# EAGLE design ptmini (EAGLE 6.6.0)
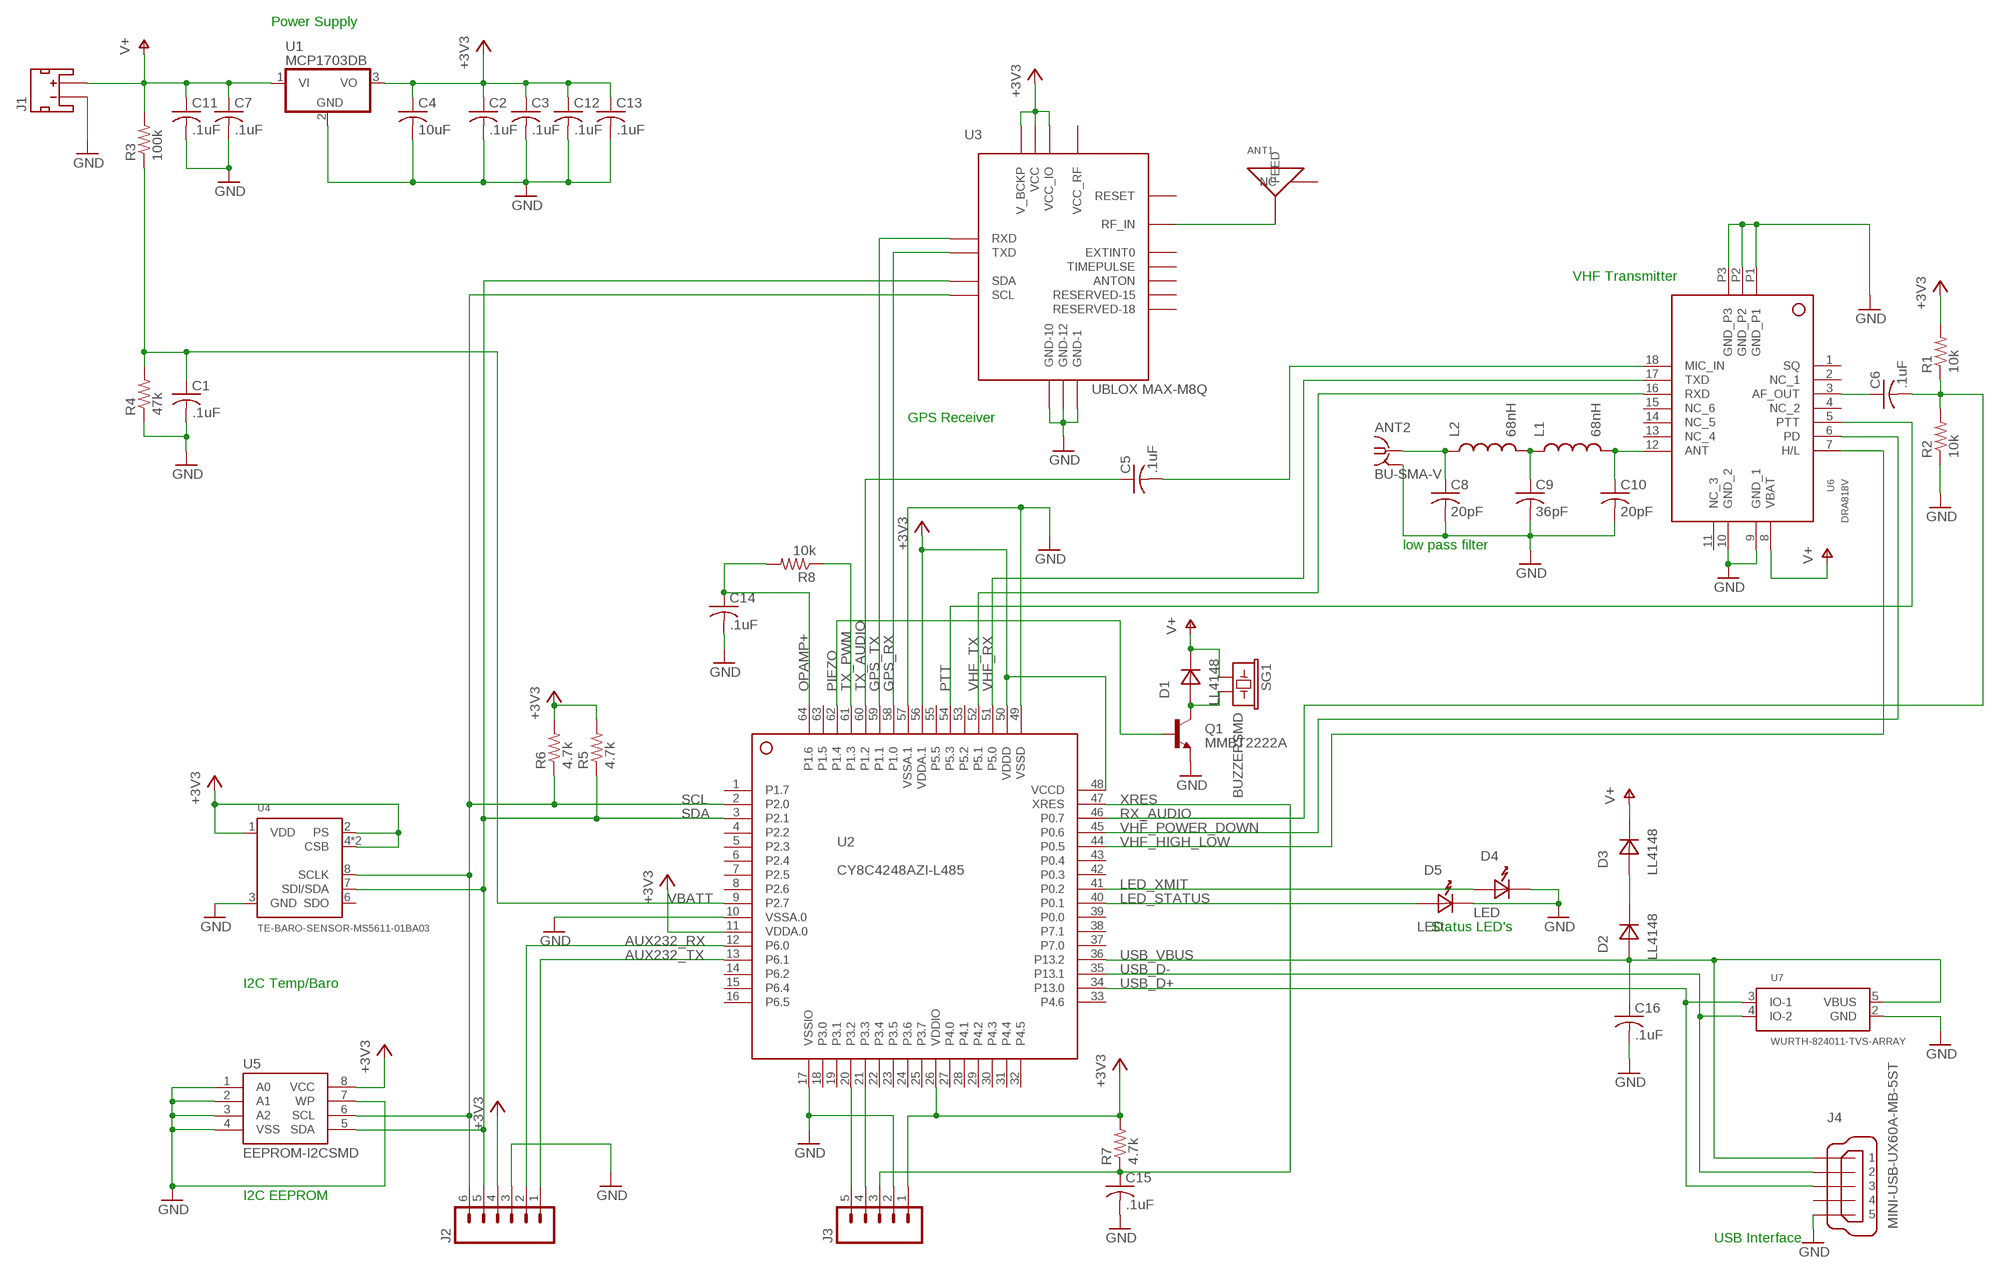
[diagram p0: schematic, sheet 1]

## Parts
ANT1  GPS_ANT_SMDBAR  [1575AT43A40]
ANT2  BU-SMA-V  [BU-SMA-V]
C1  .1uF  C-USC0805  [C0805]
C2  .1uF  C-USC0805  [C0805]
C3  .1uF  C-USC0805  [C0805]
C4  10uF  C-USC0805  [C0805]
C5  .1uF  C-USC0805  [C0805]
C6  .1uF  C-USC0805  [C0805]
C7  .1uF  C-USC0805  [C0805]
C8  20pF  C-USC0805  [C0805]
C9  36pF  C-USC0805  [C0805]
C10  20pF  C-USC0805  [C0805]
C11  .1uF  C-USC0805  [C0805]
C12  .1uF  C-USC0805  [C0805]
C13  .1uF  C-USC0805  [C0805]
C14  .1uF  C-USC0805  [C0805]
C15  .1uF  C-USC0805  [C0805]
C16  .1uF  C-USC0805  [C0805]
D1  LL4148  [SOD-80]
D2  LL4148  [SOD-80]
D3  LL4148  [SOD-80]
D4  LED  [DIODE-1206]
D5  LED  [DIODE-1206]
J1  JST_2MM_MALE  [JST-2-SMD]
J2  M06RA  [MOLEX-1X6-RA]
J3  M05LOCK  [1X05_LOCK]
J4  MINI-USB-UX60A-MB-5ST  [UX60A-MB-5ST]
L1  68nH  INDUCTOR0805  [0805]
L2  68nH  INDUCTOR0805  [0805]
Q1  MMBT2222A  TRANSISTOR_NPNMMBT2222A  [SOT23]
R1  10k  R-US_R0805  [R0805]
R2  10k  R-US_R0805  [R0805]
R3  100k  R-US_R0805  [R0805]
R4  47k  R-US_R0805  [R0805]
R5  4.7k  R-US_R0805  [R0805]
R6  4.7k  R-US_R0805  [R0805]
R7  4.7k  R-US_R0805  [R0805]
R8  10k  R-US_R0805  [R0805]
SG1  BUZZERSMD  [BUZZER-CMT1603]
U1  MCP1703DB  [SOT223]
U2  CY8C4248AZI-L485  [TQFP64-10X10]
U3  UBLOX MAX-M8Q  UBLOX-MAX  [UBLOX-MAX]
U4  TE-BARO-SENSOR-MS5611-01BA03  [TE-BARO-SENSOR-MS5611-01BA3]
U5  EEPROM-I2CSMD  [SO08]
U6  DRA818V  [SMD_DRA818]
U7  WURTH-824011-TVS-ARRAY  [SOT23-5]

## Nets
+3V3: C2.1 C3.1 C4.1 C12.1 C13.1 J2.4 J3.1 R1.2 R5.2 R6.2 R7.2 U1.3(VO) U2.11(VDDA.0) U2.26(VDDIO) U2.48(VCCD) U2.50(VDDD) U2.56(VDDA.1) U3.6_V_BCKP(V_BCKP) U3.7_VCC_IO(VCC_IO) U3.8_VCC(VCC) U4.1(VDD) U4.2(PS) U4.4(CSB) U4.5(CSB) U5.8(VCC)
AUX232_RX: J2.2 U2.12(P6.0)
AUX232_TX: J2.1 U2.13(P6.1)
GND: ANT2.2 ANT2.3 ANT2.4 ANT2.5 C1.2 C2.2 C3.2 C4.2 C7.2 C8.2 C9.2 C10.2 C11.2 C12.2 C13.2 C14.2 C15.2 C16.2 D4.CATHODE D5.CATHODE J1.1(-) J2.3 J3.2 J4.5 Q1.2(E) R2.1 R4.1 U1.2(GND) U2.10(VSSA.0) U2.17(VSSIO) U2.49(VSSD) U2.57(VSSA.1) U3.1_GND(GND-1) U3.10_GND(GND-10) U3.12_GND(GND-12) U4.3(GND) U5.1(A0) U5.2(A1) U5.3(A2) U5.4(VSS) U5.7(WP) U6.9(GND_1) U6.10(GND_2) U6.P1(GND_P1) U6.P2(GND_P2) U6.P3(GND_P3) U7.2(GND)
GPS_RX: U2.58(P1.0) U3.2_TXD1(TXD)
GPS_TX: U2.59(P1.1) U3.3_RXD1(RXD)
LED_STATUS: D5.ANODE U2.40(P0.1)
LED_XMIT: D4.ANODE U2.41(P0.2)
N$1: D1.ANODE Q1.3(C) SG1.P$2
N$2: C5.2 U6.18(MIC_IN)
N$4: ANT1.FEED U3.11_RF_IN(RF_IN)
N$5: D2.CATHODE D3.ANODE
N$8: C6.1 U6.3(AF_OUT)
N$15: ANT2.1 C8.1 L2.1
N$21: C9.1 L1.1 L2.2
N$22: C10.1 L1.2 U6.12(ANT)
N$27: J3.5 U2.20(P3.2)
N$28: J3.4 U2.21(P3.3)
OPAMP+: C14.1 R8.2 U2.64(P1.6)
PIEZO: Q1.1(B) U2.62(P1.4)
PTT: U2.54(P5.3) U6.5(PTT)
RX_AUDIO: C6.2 R1.1 R2.2 U2.46(P0.7)
SCL: J2.6 R6.1 U2.2(P2.0) U3.17_SCL2(SCL) U4.8(SCLK) U5.6(SCL)
SDA: J2.5 R5.1 U2.3(P2.1) U3.16_SDA2(SDA) U4.7(SDI/SDA) U5.5(SDA)
TX_AUDIO: C5.1 U2.60(P1.2)
TX_PWM: R8.1 U2.61(P1.3)
USB_D+: J4.3 U2.34(P13.0) U7.3(IO-1)
USB_D-: J4.2 U2.35(P13.1) U7.4(IO-2)
USB_VBUS: C16.1 D2.ANODE J4.1 U2.36(P13.2) U7.5(VBUS)
V+: C7.1 C11.1 D1.CATHODE D3.CATHODE J1.2(+) R3.2 SG1.P$1 U1.1(VI) U6.8(VBAT)
VBATT: C1.1 R3.1 R4.2 U2.9(P2.7)
VHF_HIGH_LOW: U2.44(P0.5) U6.7(H/L)
VHF_POWER_DOWN: U2.45(P0.6) U6.6(PD)
VHF_RX: U2.51(P5.0) U6.17(TXD)
VHF_TX: U2.52(P5.1) U6.16(RXD)
XRES: C15.1 J3.3 R7.1 U2.47(XRES)
Unconnected: ANT1.NC J1.NC1(PAD1) J1.NC2(PAD2) J4.4 U2.1(P1.7) U2.4(P2.2) U2.5(P2.3) U2.6(P2.4) U2.7(P2.5) U2.8(P2.6) U2.14(P6.2) U2.15(P6.4) U2.16(P6.5) U2.18(P3.0) U2.19(P3.1) U2.22(P3.4) U2.23(P3.5) U2.24(P3.6) U2.25(P3.7) U2.27(P4.0) U2.28(P4.1) U2.29(P4.2) U2.30(P4.3) U2.31(P4.4) U2.32(P4.5) U2.33(P4.6) U2.37(P7.0) U2.38(P7.1) U2.39(P0.0) U2.42(P0.3) U2.43(P0.4) U2.53(P5.2) U2.55(P5.5) U2.63(P1.5) U3.4_TIMEPULSE(TIMEPULSE) U3.5_EXTINT0(EXTINT0) U3.13_ANTON(ANTON) U3.14_VCC_RF(VCC_RF) U3.15_RESERVED(RESERVED-15) U3.18_RESERVED(RESERVED-18) U4.6(SDO) U6.1(SQ) U6.2(NC_1) U6.4(NC_2) U6.11(NC_3) U6.13(NC_4) U6.14(NC_5) U6.15(NC_6)

## Notes on the sheet
- Power Supply
- VHF Transmitter
- GPS Receiver
- low pass filter
- Status LED's
- I2C Temp/Baro
- I2C EEPROM
- USB Interface

## Power pins joined to a net without a drawn wire
RESET: U3.9_V_RESET(RESET)

## Library data of the parts
ANT1 = Parts:GPS_ANT_SMDBAR: 1.575 GHz GPS Antenna Johanson Technology http://www.digikey.com/product-detail/en/1575AT43A0040E/712-1003-1-ND/1560832; DIGIKEY: 712-1003-1-ND
ANT2 = con-coax:BU-SMA-V: FEMALE SMA CONNECTOR Radiall distributor RS 112-3794; DIGIKEY: CONSMA001-ND; OC_FARNELL: unknown; OC_NEWARK: unknown
C1-C3 C5-C7 C11-C16 = resistor:C-US: CAPACITOR, American symbol; DIGIKEY: 311-1361-1-ND
C4 = resistor:C-US: CAPACITOR, American symbol; DIGIKEY: 490-3886-1-ND
C8 C10 = resistor:C-US: CAPACITOR, American symbol; DIGIKEY: 712-1381-1-ND
C9 = resistor:C-US: CAPACITOR, American symbol; DIGIKEY: 712-1387-1-ND
D1-D3 = custom-ds:LL4148: General purpose LL1448 Diode in the SOD-80 (glass tube) form factor.; DIGIKEY: 568-1749-1-ND
D4 = custom-ds:LED: Light Emitting Diode (LED) in a 1206 SMT package.; DIGIKEY: 160-1405-1-ND
D5 = custom-ds:LED: Light Emitting Diode (LED) in a 1206 SMT package.; DIGIKEY: 160-1169-1-ND
J1 = SparkFun-Connectors:JST_2MM_MALE: Mates to single-cell LiPo batteries. CONN-08352; DIGIKEY: 455-1749-1-ND; PROD_ID: CONN-08352
J2 = SparkFun-Connectors:M06: Header 6 Standard 6-pin 0.1" header. Use with straight break away headers (SKU : PRT-00116), right angle break away headers (PRT-00553), swiss pins (PRT-00743), machine pins (PRT-00117), and female headers (PRT-00115). Molex polarized connector foot print use with SKU : PRT-08094 with associated crimp pins and housings. NOTES ON THE VARIANTS LOCK and LOCK_LONGPADS... This footprint was designed to help hold the alignment of a through-hole component (i.e. 6-pin header) while soldering it into place. You may notice that each hole has been shifted either up or down by 0.005 of an inch from it's more standard position (which is a perfectly straight line). This slight alteration caused the pins (the squares in the middle) to touch the edges of the holes. Because they are alternating, it causes a "brace" to hold the component in place. 0.005 has proven to be the perfect amount of "off-center" position when using our standard breakaway headers. Although looks a little odd when you look at the bare footprint, once you have a header in there, the alteration is very hard to notice. Also,if you push a header all the way into place, it is covered up entirely on the bottom side. This idea of altering the position of holes to aid alignment will be further integrated into the Sparkfun Library for other footprints. It can help hold any component with 3 or more connection pins.; DIGIKEY: WM4304-ND
J3 = SparkFun-Connectors:M05: Header 5 Standard 5-pin 0.1" header. Use with straight break away headers (SKU : PRT-00116), right angle break away headers (PRT-00553), swiss pins (PRT-00743), machine pins (PRT-00117), and female headers (PRT-00115). Molex polarized connector foot print use with SKU : PRT-08230 with associated crimp pins and housings.; DIGIKEY: SAM1112-32-ND
J4 = con-hirose:MINI-USB-: MINI USB Connector Source: http://www.hirose.co.jp/cataloge_hp/e24000019.pdf; DIGIKEY: H2961CT-ND; OC_FARNELL: unknown; OC_NEWARK: unknown
L1 L2 = SparkFun-Passives:INDUCTOR: Inductors Basic Inductor/Choke - 0603 and 1206. Footprints are not proven and vary greatly between part numbers. SRN6045- 33uH, 20% 1.4A SDR0403-560KL - 56uH, 10%, 500mA RMS/740mA peak; DIGIKEY: AISC-0805-R068G-TCT-ND
Q1 = SparkFun-DiscreteSemi:TRANSISTOR_NPN: Generic NPN BJT MMBT2222A - TRANS-08049 (SOT-23, 1A 40V) MPSA42 - TRANS-09116 (SOT-23, 500mA 300V) MMBT5088LT1G - TRANS-11160 (SOT-23, 50 mA 30V); DIGIKEY: MMBT2222AFSCT-ND; PROD_ID: TRANS-08049
R1 R2 R8 = resistor:R-US_: RESISTOR, American symbol; DIGIKEY: 311-10.0KCRCT-ND
R3 = resistor:R-US_: RESISTOR, American symbol; DIGIKEY: 311-100KCRCT-ND
R4 = resistor:R-US_: RESISTOR, American symbol; DIGIKEY: 311-47.0KCRCT-ND
R5-R7 = resistor:R-US_: RESISTOR, American symbol; DIGIKEY: 311-4.7KARCT-ND
SG1 = SparkFun-Electromechanical:BUZZER: Buzzer 12mm Spark Fun Electronics SKU : Comp-Buzzer; DIGIKEY: 102-1193-1-ND
U1 = linear:MCP1703: 250 mA, 16V, Low Quiescent Current LDO Regulator Source: http://ww1.microchip.com/downloads/en/DeviceDoc/22049b.pdf; DIGIKEY: MCP1703T-3302E/DBCT-ND
U2 = custom-ds:CY8C4248AZI-L485: Cypress PSoC 4200 series chip. Specifically tested with CY8C4248AZI-L485. Note this is a 10mm square TQFP-64.; DIGIKEY: 428-3598-ND
U3 = custom-ds:UBLOX-MAX: UBlox MAX-series of GPS receiver engines.
U4 = custom-ds:TE-BARO-SENSOR-MS5611-01BA03: TE Connectivity High Precision Barometric Pressure Sensor.; DIGIKEY: 223-1622-1-ND
U5 = SparkFun-DigitalIC:EEPROM-I2C: I2C EEPROM chips, 24LC256 (and others); DIGIKEY: 24LC64F-I/SN-ND
U6 = DRA818V:DRA818V: DRA818V is a compact wireless voice transceiver from Dorji. http://www.dorji.com/pro/Modules/Audio_voice_transceiver.html
U7 = custom-ds:WURTH-824011-TVS-ARRAY: USB TVS Protection array such as Wurth Elektronik 824011.; DIGIKEY: 732-4465-1-ND

## Board
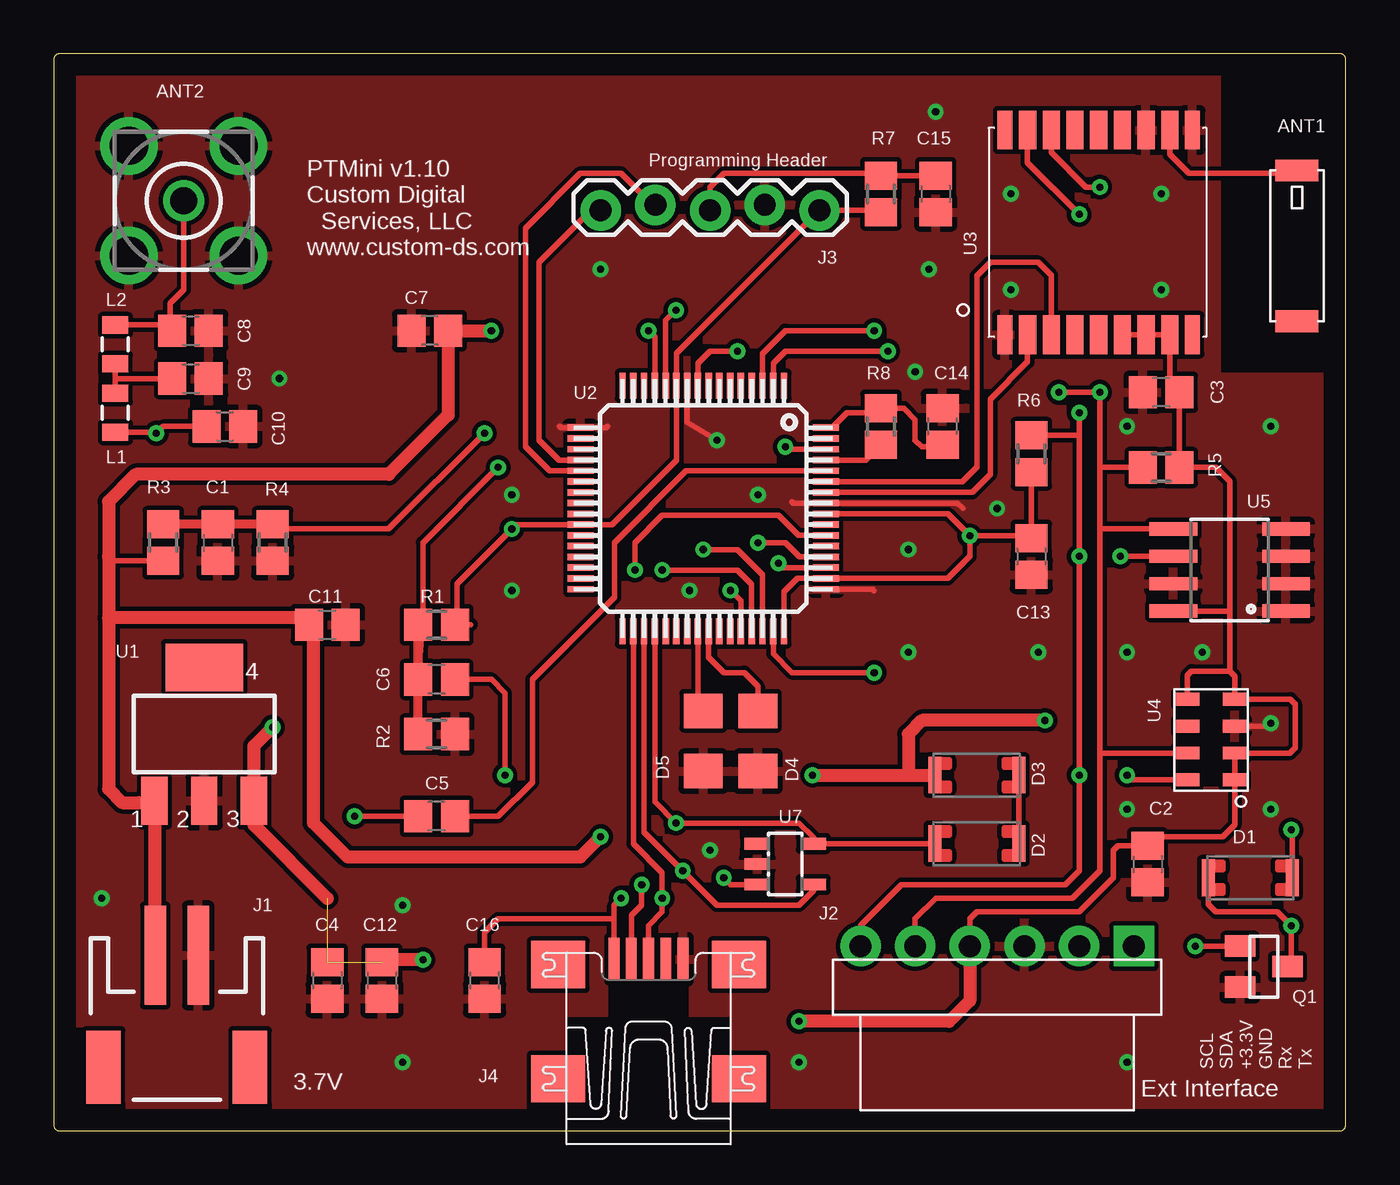
[diagram p1: board, top side]
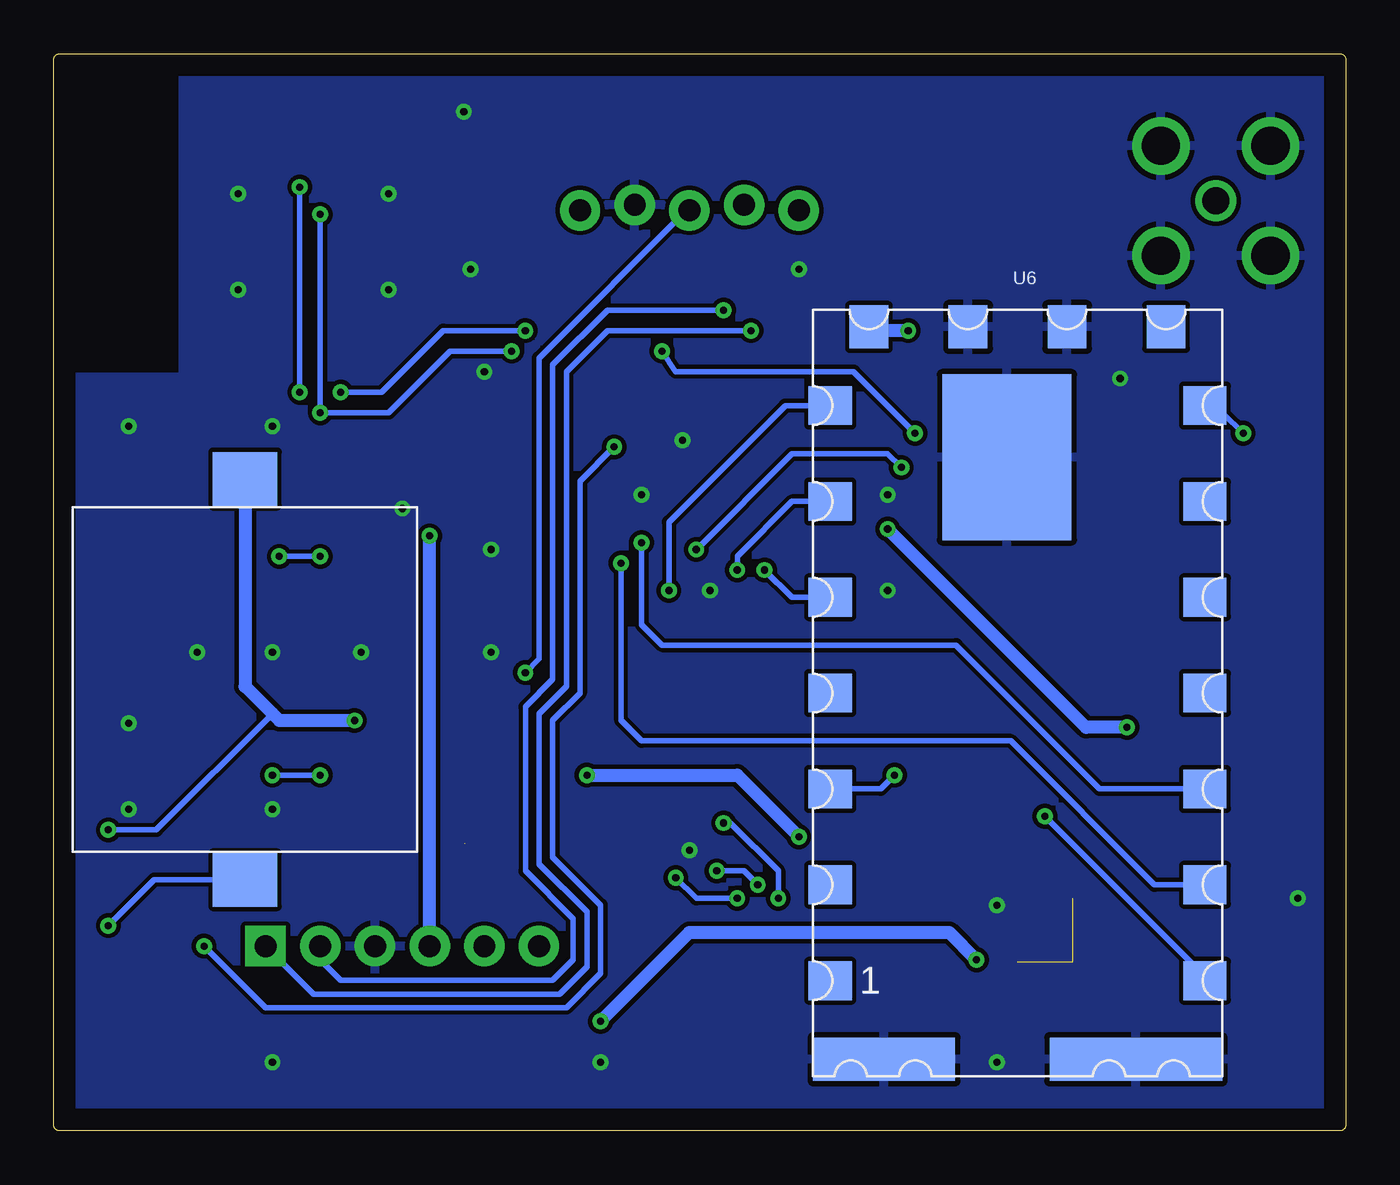
[diagram p2: board, bottom side, seen from below]

Size 60 x 50 mm. Coordinates in mm from the lower left corner, seen from the top.
Outline: 0,49.75 0,0.25 arc90 0.25,0 59.75,0 arc90 60,0.25 60,49.75 arc90 59.75,50 0.25,50 arc90 0,49.75
Copper layers (1*16): Top 0.035mm / dielectric 1.5mm / Bottom 0.035mm
Design rules "default *": minimum track width 10mil, minimum drill 13mil, track to track 8mil, track to pad 8mil, pad to pad 8mil, via to via 8mil, smd to smd 8mil, copper to edge 40mil, drill to drill 8mil, minimum pad ring 10mil, minimum via ring 8mil, stop-mask expansion 4mil, vias tented up to drill 0mil, thermal gap 10mil

### Footprints (pad centres in the part's own frame; a part is rotated, then mirrored left to right if it is on the bottom)
1575AT43A40 = smd 1 x 2: FEED 0.5,-1; NC 7.5,-1
BU-SMA-V = drill 1.27: 1 0,0 | drill 1.778: 2 -2.55,2.55; 3 2.55,2.55; 4 2.55,-2.55; 5 -2.55,-2.55
C0805 = smd 1.3 x 1.5: 1 -0.85,0; 2 0.85,0
SOD-80 = smd 0.6 x 1.7: ANODE -1.95,0; CATHODE 1.95,0
DIODE-1206 = smd 1.6 x 1.8: ANODE -1.4,0; CATHODE 1.4,0
JST-2-SMD = smd 1 x 4.6: 1 -1,-3.7; 2 1,-3.7 | smd 1.6 x 3.4: NC1 -3.4,1.5; NC2 3.4,1.5
MOLEX-1X6-RA = drill 1.016 pad 1.88 square: 1 0,0 | drill 1.016 pad 1.88: 2 2.54,0; 3 5.08,0; 4 7.62,0; 5 10.16,0; 6 12.7,0
1X05_LOCK = drill 1.016 pad 1.88: 1 0,0.127; 2 2.54,-0.127; 3 5.08,0.127; 4 7.62,-0.127; 5 10.16,0.127
UX60A-MB-5ST = smd 2 x 0.5: 1 2.25,1.6; 2 2.25,0.8; 3 2.25,0; 4 2.25,-0.8; 5 2.25,-1.6 | smd 2.2 x 2.5: M1 -3.3,-4.2; M2 -3.3,4.2; M3 2,4.2; M4 2,-4.2
0805 = smd 0.8 x 1.2: 1 -0.9,0; 2 0.9,0
SOT23 = smd 1 x 1.4: 1 -0.95,-1.1; 2 0.95,-1.1; 3 0,1.1
R0805 = smd 1.3 x 1.5: 1 -0.85,0; 2 0.85,0
BUZZER-CMT1603 = smd 2.5 x 3: P$1 -9.3,0; P$2 9.3,0
SOT223 = smd 1.219 x 2.235: 1 -2.311,-3.099; 2 0,-3.099; 3 2.311,-3.099 | smd 3.6 x 2.2: 4 0,3.099
TQFP64-10X10 = smd 1.2 x 0.297: 1 -5.7,3.75; 2 -5.7,3.25; 4 -5.7,2.25; 5 -5.7,1.75; 6 -5.7,1.25; 7 -5.7,0.75; 8 -5.7,0.25; 9 -5.7,-0.25; 10 -5.7,-0.75; 11 -5.7,-1.25; 12 -5.7,-1.75; 13 -5.7,-2.25; 14 -5.7,-2.75; 15 -5.7,-3.25; 16 -5.7,-3.75; 33 5.7,-3.75; 34 5.7,-3.25; 35 5.7,-2.75; 36 5.7,-2.25; 37 5.7,-1.75; 38 5.7,-1.25; 39 5.7,-0.75; 40 5.7,-0.25; 41 5.7,0.25; 42 5.7,0.75; 43 5.7,1.25; 44 5.7,1.75; 45 5.7,2.25; 46 5.7,2.75; 47 5.7,3.25; 48 5.7,3.75 | smd 1.2 x 0.3: 3 -5.7,2.75 | smd 0.297 x 1.2: 17 -3.75,-5.7; 18 -3.25,-5.7; 19 -2.75,-5.7; 20 -2.25,-5.7; 21 -1.75,-5.7; 22 -1.25,-5.7; 23 -0.75,-5.7; 24 -0.25,-5.7; 25 0.25,-5.7; 26 0.75,-5.7; 27 1.25,-5.7; 28 1.75,-5.7; 29 2.25,-5.7; 30 2.75,-5.7; 31 3.25,-5.7; 32 3.75,-5.7; 49 3.75,5.7; 50 3.25,5.7; 51 2.75,5.7; 52 2.25,5.7; 53 1.75,5.7; 54 1.25,5.7; 55 0.75,5.7; 56 0.25,5.7; 57 -0.25,5.7; 58 -0.75,5.7; 59 -1.25,5.7; 60 -1.75,5.7; 61 -2.25,5.7; 62 -2.75,5.7; 63 -3.25,5.7; 64 -3.75,5.7
UBLOX-MAX = smd 1.8 x 0.7: 1_GND -4.95,4.4; 9_V_RESET -4.95,-4.3; 10_GND 4.55,-4.3; 18_RESERVED 4.55,4.4 | smd 1.8 x 0.8: 2_TXD1 -4.95,3.35; 3_RXD1 -4.95,2.25; 4_TIMEPULSE -4.95,1.15; 5_EXTINT0 -4.95,0.05; 6_V_BCKP -4.95,-1.05; 7_VCC_IO -4.95,-2.15; 8_VCC -4.95,-3.25; 11_RF_IN 4.55,-3.25; 12_GND 4.55,-2.15; 13_ANTON 4.55,-1.05; 14_VCC_RF 4.55,0.05; 15_RESERVED 4.55,1.15; 16_SDA2 4.55,2.25; 17_SCL2 4.55,3.35
TE-BARO-SENSOR-MS5611-01BA3 = smd 1.1 x 0.6: 1 -1,2; 2 -1,0.75; 3 -1,-0.5; 4 -1,-1.75; 5 1.2,-1.75; 6 1.2,-0.5; 7 1.2,0.75; 8 1.2,2
SO08 = smd 0.61 x 2.21: 1 -1.905,-2.616; 2 -0.635,-2.616; 3 0.635,-2.616; 4 1.905,-2.616; 5 1.905,2.616; 6 0.635,2.616; 7 -0.635,2.616; 8 -1.905,2.616
SMD_DRA818 = smd 1.8 x 2: 1 -13.35,8.7; 2 -8.9,8.7; 3 -4.45,8.7; 4 0,8.7; 5 4.45,8.7; 6 8.9,8.7; 7 13.35,8.7; 12 13.35,-8.7; 13 8.9,-8.7; 14 4.45,-8.7; 15 0,-8.7; 16 -4.45,-8.7; 17 -8.9,-8.7; 18 -13.35,-8.7 | smd 2 x 1.8: 8 17,6.9; 9 17,2.3; 10 17,-2.3; 11 17,-6.9 | smd 7.7 x 6: P1 10.95,0.5 | smd 2 x 6.6: P2 -17,6.2 | smd 2 x 8: P3 -17,-5.5
SOT23-5 = smd 0.55 x 1.2: 1 -0.95,-1.3; 2 0,-1.3; 3 0.95,-1.3; 4 0.95,1.3; 5 -0.95,1.3

### Placement (x,y rotation side)
ANT1  58.74,45.09 270 top
ANT2  6.03,43.18 0 top
C1  7.62,27.3 270 top
C2  50.8,12.38 270 top
C3  51.44,34.29 180 top
C4  12.7,6.99 270 top
C5  17.78,14.61 180 top
C6  17.78,20.95 180 top
C7  17.46,37.15 180 top
C8  6.35,37.15 0 top
C9  6.35,34.92 0 top
C10  7.94,32.7 0 top
C11  12.7,23.5 0 top
C12  15.24,6.99 270 top
C13  45.4,26.67 270 top
C14  41.27,32.7 90 top
C15  40.96,43.5 270 top
C16  20,6.99 270 top
D1  55.56,11.75 0 top
D2  42.86,13.34 0 top
D3  42.86,16.51 180 top
D4  32.7,18.1 270 top
D5  30.16,18.1 270 top
J1  5.71,4.45 180 top
J2  50.16,8.57 180 top
J3  35.56,42.86 180 top
J4  27.62,5.71 90 top
L1  2.86,33.34 270 top
L2  2.86,36.51 270 top
Q1  56.2,7.62 270 top
R1  17.78,23.5 0 top
R2  17.78,18.41 180 top
R3  5.08,27.3 270 top
R4  10.16,27.3 90 top
R5  51.44,30.8 0 top
R6  45.4,31.43 270 top
R7  38.42,43.5 270 top
R8  38.42,32.7 90 top
SG1  51.12,20.95 270 bottom
U1  6.99,18.41 0 top
U2  30.16,28.89 270 top
U3  48.58,41.91 90 top
U4  53.85,18.29 180 top
U5  54.61,26.04 90 top
U6  15.24,20.32 90 bottom
U7  33.97,12.38 270 top

### Tracks (layer width: path | path; a pad name or v marks a point on that pad's centre or on a via)
+3V3  (via drill 0.33)  (2 unrouted)
  Top 0.254: 19.37,23.5 R1.2 | R1.2 18.41,23.5 | 21.34,28.01 v21.27,27.94 | U3.8_VCC U3.7_VCC_IO U3.6_V_BCKP | U2.48 33.91,25.02 34.53,25.64 U2.50 41.52,25.64 42.55,26.67 v42.55,27.62 | v21.27,27.94 21.48,28.14 U2.26 25.92,28.14 28.91,31.14 U2.11 28.91,36.09 J3.1 38.33,42.74 R7.2 | 54.61,24.13 54.61,30.16 53.98,30.8 R5.2 C3.1 51.83,34.75 U3.8_VCC | U5.8 54.61,24.13 | J2.4 42.55,9.84 42.86,10.16 47.62,10.16 49.21,11.75 49.21,13.02 49.43,13.23 C2.1 51.22,13.65 54.29,13.65 54.85,14.21 U4.1 U4.2 57.42,17.54 57.66,17.78 57.66,19.81 57.43,20.04 U4.4 54.85,21.1 54.61,21.34 | v42.55,27.62 45.3,27.62 C13.1 R6.2 | U2.56 41.52,28.64 v42.55,27.62 | U3.8_VCC 51.83,37.29 | v21.27,27.94 18.73,25.4 18.73,23.6 R1.2 | 54.61,24.13 54.61,21.34 | U4.5 52.65,21.15 52.83,21.34 54.61,21.34
  Top 0.61: v10.16,18.73 9.3,17.87 U1.3 9.3,14.2 12.7,10.79 | J2.4 42.55,6.03 41.59,5.08 v34.61,5.08 | v17.14,7.94 15.34,7.94 C12.1
  Bottom 0.61: v10.16,18.73 12.06,18.73 v21.27,27.94 | v34.61,5.08 30.48,9.21 18.41,9.21 v17.14,7.94 | J2.4 v42.55,27.62
AUX232_RX  (via drill 0.33)
  Top 0.254: U2.12 28.41,37.62 v28.89,38.1
  Bottom 0.254: v28.89,38.1 34.29,38.1 36.83,35.56 36.83,20.95 38.1,19.68 38.1,12.06 35.88,9.84 35.88,7.94 36.83,6.99 46.67,6.99 47.62,7.94 J2.2
AUX232_TX  (via drill 0.33)
  Top 0.254: U2.13 27.91,36.86 v27.62,37.15
  Bottom 0.254: v27.62,37.15 34.29,37.15 36.2,35.24 36.2,20.64 37.47,19.37 37.47,12.38 35.24,10.16 35.24,7.62 36.51,6.35 47.94,6.35 J2.1
GND  (via drill 0.33)
  Top 0.254: U2.10 29.41,32.91 v30.8,32.07 | 34.29,29.21 34.36,29.14 U2.57 41.98,29.14 42.23,28.89 | 23.5,32.7 23.55,32.64 U2.17 25.66,32.64 25.72,32.7 | U2.49 38.04,25.14 38.1,25.08 | U4.3 56.38,18.79 v56.52,18.92
  other vias: 40.96,47.31 40.64,40.01 39.69,26.99 25.4,40.01 49.85,32.7 29.53,25.08 43.81,28.89 51.44,43.5 53.34,22.23 56.52,14.92 32.7,29.53 49.85,14.92 44.45,43.5 45.72,22.23 51.44,39.05 40.01,35.24 39.69,22.23 44.45,39.05 56.52,32.7 10.48,34.92 16.19,3.17 21.27,29.53 2.22,10.79 34.61,3.17 16.19,10.48 49.85,3.17 49.85,22.23 30.48,13.02 21.27,25.08
  pour Top: 54,35 60,35 60,0 0,0 0,50 54,50
  pour Bottom: 60,35 54,35 54,50 0,50 0,0 60,0
GPS_RX
  Top 0.254: U2.58 42.66,29.64 43.5,30.48 43.5,33.97 45.23,35.7 U3.2_TXD1 45.23,36.97
GPS_TX
  Top 0.254: U2.59 42.21,30.14 42.86,30.8 42.86,39.69 43.5,40.32 45.72,40.32 46.33,39.72 U3.3_RXD1
LED_STATUS
  Top 0.254: U2.40 29.91,19.75 D5.ANODE
LED_XMIT
  Top 0.254: U2.41 30.41,21.98 31.11,21.27 32.07,21.27 32.7,20.64 D4.ANODE
N$1  (via drill 0.33)
  Top 0.254: Q1.3 57.47,7.79 v57.47,9.53 56.83,10.16 53.98,10.16 53.61,10.52 D1.ANODE
  Bottom 0.254: SG1.P$2 55.34,11.65 v57.47,9.53
N$2  (via drill 0.33)
  Top 0.254: v13.97,14.61 C5.2
  Bottom 0.254: U6.18 6.54,7.17 v13.97,14.61
N$4
  Top 0.254: U3.11_RF_IN 51.83,45.33 52.7,44.45 57.6,44.45 ANT1.FEED
N$5
  Top 0.254: D2.CATHODE D3.ANODE
N$8  (via drill 0.33)
  Top 0.254: v20.95,16.51 20.95,20.32 20.32,20.95 C6.1
  Bottom 0.254: v20.95,16.51 21.59,15.88 U6.3
N$15
  Top 0.254: L2.1 5.24,37.41 C8.1 5.4,37.25 5.4,38.42 6.03,39.05 ANT2.1
N$21
  Top 0.254: L1.1 2.86,34.92 | 2.86,34.92 L2.2 | C9.1 2.86,34.92
N$22  (via drill 0.33)
  Top 0.254: L1.2 4.71,32.44 v4.76,32.38 5.08,32.7 C10.1
  Bottom 0.254: U6.12 5.7,33.67 5.7,33.32 v4.76,32.38
N$27
  Top 0.254: U2.20 23.47,31.14 22.54,32.07 22.54,40.32 24.96,42.74 J3.5
N$28
  Top 0.254: U2.21 23.02,30.64 21.91,31.75 21.91,41.91 24.45,44.45 26.35,44.45 27.81,42.99 J3.4
OPAMP+
  Top 0.254: U2.64 36.13,32.64 36.83,33.34 38.2,33.34 R8.2 39.47,33.55 40.01,33.02 40.01,32.07 40.32,31.75 41.17,31.75 C14.1
PIEZO  (via drill 0.33)
  Top 0.254: U2.62 34.08,31.64 v33.97,31.75 | Q1.1 v53.02,8.57
  Bottom 0.254: v33.97,31.75 35.56,30.16 35.56,20.32 36.83,19.05 36.83,12.7 34.61,10.48 34.61,7.3 36.2,5.71 50.16,5.71 v53.02,8.57
PTT  (via drill 0.33)
  Top 0.254: U2.54 34.59,27.64 33.66,28.57 28.26,28.57 26.99,27.3 v26.99,26.04
  Bottom 0.254: U6.5 25.72,24.77 v26.99,26.04
RX_AUDIO  (via drill 0.33)
  Top 0.254: v20.64,30.8 17.14,27.3 17.14,23.71 C6.2 | U2.46 32.91,25.82 31.75,26.99 v30.16,26.99
  Top 0.406: R2.2 R1.1 C6.2
  Bottom 0.254: v30.16,26.99 25.72,31.43 21.27,31.43 v20.64,30.8
SCL  (via drill 0.33)
  Top 0.254: v47.62,33.34 47.62,32.38 | 47.62,32.38 v47.62,26.67 v47.62,16.51 47.62,12.06 46.99,11.43 39.37,11.43 37.47,9.53 J2.6 | U2.2 33.41,35.63 33.97,36.2 v38.73,36.2 | U5.6 v49.53,26.67 | 49.94,16.41 v49.85,16.51 50.07,16.29 U4.8 | v47.62,42.55 45.23,44.94 U3.17_SCL2 | R6.1 47.52,32.28 47.62,32.38
  Bottom 0.254: v49.53,26.67 v47.62,26.67 | v49.85,16.51 v47.62,16.51 | v47.62,42.55 v47.62,33.34 44.45,33.34 41.59,36.2 v38.73,36.2
SDA  (via drill 0.33)
  Top 0.254: 48.58,30.8 v48.58,34.29 v46.67,34.29 | 48.58,30.8 48.58,27.94 | U2.3 32.91,36.09 33.97,37.15 v38.1,37.15 | U5.5 48.58,27.94 | 48.58,27.94 48.58,17.53 | 48.58,17.53 48.58,12.06 47.31,10.79 40.96,10.79 40.01,9.84 J2.5 | R5.1 48.58,30.8 | U3.16_SDA2 46.33,45.43 47.94,43.81 v48.58,43.81 | U4.7 48.59,17.54 48.58,17.53
  Bottom 0.254: v48.58,43.81 v48.58,34.29 | v46.67,34.29 44.77,34.29 41.91,37.15 v38.1,37.15
TX_AUDIO
  Top 0.254: C5.1 20.64,14.61 22.23,16.19 22.23,20.95 26.04,24.77 26.04,27.3 29.37,30.64 U2.60
TX_PWM
  Top 0.254: U2.61 37.71,31.14 R8.1
USB_D+  (via drill 0.33)
  Top 0.254: U2.34 26.91,13.34 28.26,11.99 v28.26,10.79 28.26,10.16 27.62,9.53 J4.3 | U7.3 31.43,11.43 v31.11,11.75
  Bottom 0.254: v28.26,10.79 30.16,10.79 v31.11,11.75
USB_D-  (via drill 0.33)
  Top 0.254: U2.35 27.41,13.86 v29.21,12.06 30.8,10.48 34.61,10.48 35.27,11.14 U7.4 | J4.2 26.82,9.99 27.3,10.48 v27.3,11.43
  Bottom 0.254: v29.21,12.06 27.94,12.06 v27.3,11.43
USB_VBUS  (via drill 0.33)  (1 unrouted)
  Top 0.254: U2.36 27.91,15.27 v28.89,14.29 34.61,14.29 35.27,13.62 U7.5 D2.ANODE | J4.1 26.02,9.84 | 26.02,9.84 26.02,10.46 v26.35,10.79 | C16.1 20,9.21 20.64,9.84 26.02,9.84
  Bottom 0.254: v28.89,14.29 28.57,14.29 26.35,12.06 v26.35,10.79
V+  (via drill 0.33)
  Top 0.254: R3.2 2.75,26.45 2.54,26.67 | D1.CATHODE 57.51,13.93 v57.47,13.97
  Top 0.61: 2.54,23.81 2.54,26.67 2.54,29.21 3.81,30.48 15.56,30.48 18.31,33.23 C7.1 v20.32,37.15 | 2.54,23.81 2.54,15.88 3.17,15.24 3.96,15.24 U1.1 4.71,15.28 J1.2 | v25.4,13.65 24.45,12.7 13.65,12.7 12.06,14.29 12.06,23.28 C11.1 11.53,23.81 2.54,23.81 | v35.24,16.51 39.69,16.51 | 39.69,16.51 D3.CATHODE | v46.04,19.05 40.32,19.05 39.69,18.41 39.69,16.51
  Bottom 0.254: v57.47,13.97 55.24,13.97 49.85,19.37
  Bottom 0.61: 22.14,37.55 U6.8 21.97,37.15 v20.32,37.15 | v35.24,16.51 28.26,16.51 v25.4,13.65 | v46.04,19.05 49.53,19.05 49.85,19.37 51.12,20.64 SG1.P$1
VBATT  (via drill 0.33)
  Top 0.254: v20,32.38 15.56,27.94 10.38,27.94 R4.2 | U2.9 29.91,35.63 30.48,36.2 v31.75,36.2
  Top 0.406: R4.2 C1.1 R3.1
  Bottom 0.254: v20,32.38 22.86,35.24 31.11,35.24 v31.75,36.2
VHF_HIGH_LOW  (via drill 0.33)
  Top 0.254: U2.44 31.91,24.6 v31.43,25.08
  Bottom 0.254: v31.43,25.08 31.43,28.26 26.02,33.67 U6.7
VHF_POWER_DOWN  (via drill 0.33)
  Top 0.254: U2.45 32.41,25.37 31.75,26.04 v28.26,26.04
  Bottom 0.254: U6.6 25.71,29.22 28.26,26.67 v28.26,26.04
VHF_RX  (via drill 0.33)
  Top 0.254: U2.51 33.87,26.14 v33.66,26.35
  Bottom 0.254: U6.17 8.88,11.42 15.56,18.1 32.7,18.1 33.66,19.05 v33.66,26.35
VHF_TX  (via drill 0.33)
  Top 0.254: U2.52 34.63,26.64 33.97,27.3 v32.7,27.3
  Bottom 0.254: v32.7,27.3 32.7,23.5 31.75,22.54 18.1,22.54 11.43,15.88 U6.16
XRES  (via drill 0.33)
  Top 0.254: C15.1 R7.1 38.31,44.45 31.11,44.45 30.48,43.81 J3.3 | U2.47 33.41,22.15 34.29,21.27 v38.1,21.27
  Bottom 0.254: v38.1,21.27 37.47,21.91 37.47,35.88 30.61,42.74 J3.3

### Text on the board
tNames: Programming Header | PTMini v1.10 / Custom Digital / Services, LLC / www.custom-ds.com | SCL / SDA / +3.3V / GND / Rx / Tx | 3.7V | Ext Interface